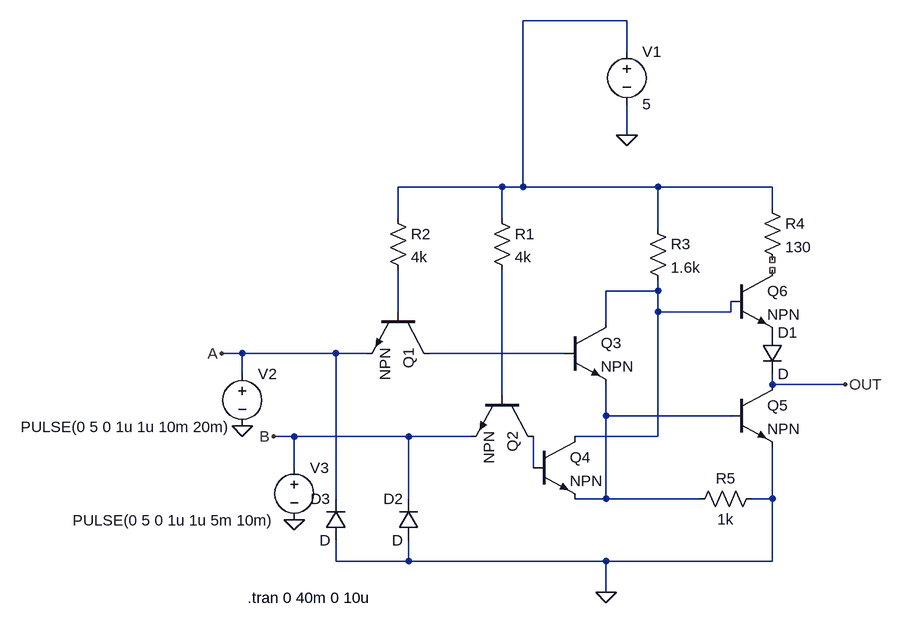
[diagram p0: schematic 74ls02_mock.asc]
74ls02_mock.asc, the LTspice schematic file:
Version 4.1
SHEET 1 880 680
WIRE 368 -352 208 -352
WIRE 368 -304 368 -352
WIRE 368 -176 368 -224
WIRE 176 -96 16 -96
WIRE 208 -96 208 -352
WIRE 208 -96 176 -96
WIRE 416 -96 208 -96
WIRE 592 -96 416 -96
WIRE 592 -64 592 -96
WIRE 16 -48 16 -96
WIRE 176 -48 176 -96
WIRE 416 -32 416 -96
WIRE 416 64 416 48
WIRE 416 64 336 64
WIRE 16 96 16 32
WIRE 416 96 416 64
WIRE 528 96 528 80
WIRE 528 96 416 96
WIRE 336 112 336 64
WIRE -224 160 -256 160
WIRE -80 160 -224 160
WIRE -32 160 -80 160
WIRE 272 160 64 160
WIRE -224 192 -224 160
WIRE 592 208 592 192
WIRE 704 208 592 208
WIRE 176 224 176 32
WIRE 336 256 336 208
WIRE 528 256 336 256
WIRE -144 288 -176 288
WIRE 32 288 -144 288
WIRE 128 288 32 288
WIRE 416 288 416 96
WIRE 416 288 288 288
WIRE -144 336 -144 288
WIRE 224 336 224 288
WIRE -80 384 -80 160
WIRE 32 384 32 288
WIRE 336 384 336 256
WIRE 336 384 288 384
WIRE 480 384 336 384
WIRE 592 384 592 304
WIRE 592 384 560 384
WIRE -80 480 -80 448
WIRE 32 480 32 448
WIRE 32 480 -80 480
WIRE 336 480 32 480
WIRE 592 480 592 384
WIRE 592 480 336 480
WIRE 336 528 336 480
FLAG 368 -176 0
FLAG -224 272 0
FLAG -144 416 0
FLAG -256 160 A
FLAG -176 288 B
FLAG 336 528 0
FLAG 704 208 OUT
SYMBOL voltage 368 -320 R0
WINDOW 123 0 0 Left 0
WINDOW 39 0 0 Left 0
SYMATTR InstName V1
SYMATTR Value 5
SYMBOL voltage -224 176 R0
WINDOW 3 -341 97 Left 2
WINDOW 123 0 0 Left 0
WINDOW 39 0 0 Left 0
SYMATTR InstName V2
SYMATTR Value PULSE(0 5 0 1u 1u 10m 20m)
SYMBOL voltage -144 320 R0
WINDOW 3 -341 97 Left 2
WINDOW 123 0 0 Left 0
WINDOW 39 0 0 Left 0
SYMATTR InstName V3
SYMATTR Value PULSE(0 5 0 1u 1u 5m 10m)
SYMBOL npn 64 96 R90
SYMATTR InstName Q1
SYMBOL npn 224 224 R90
SYMATTR InstName Q2
SYMBOL npn 272 112 R0
SYMATTR InstName Q3
SYMBOL npn 224 288 R0
SYMATTR InstName Q4
SYMBOL npn 528 208 R0
SYMATTR InstName Q5
SYMBOL npn 528 32 R0
SYMATTR InstName Q6
SYMBOL res 160 -64 R0
SYMATTR InstName R1
SYMATTR Value 4k
SYMBOL res 0 -64 R0
SYMATTR InstName R2
SYMATTR Value 4k
SYMBOL res 400 -48 R0
SYMATTR InstName R3
SYMATTR Value 1.6k
SYMBOL res 576 -80 R0
SYMATTR InstName R4
SYMATTR Value 130
SYMBOL diode 576 128 R0
SYMATTR InstName D1
SYMBOL res 576 368 R90
WINDOW 0 0 56 VBottom 2
WINDOW 3 32 56 VTop 2
SYMATTR InstName R5
SYMATTR Value 1k
SYMBOL diode 48 448 R180
WINDOW 0 24 64 Left 2
WINDOW 3 24 0 Left 2
SYMATTR InstName D2
SYMBOL diode -64 448 R180
WINDOW 0 24 64 Left 2
WINDOW 3 24 0 Left 2
SYMATTR InstName D3
TEXT -216 536 Left 2 !.tran 0 40m 0 10u

The netlist it stands for:
* 74ls02_mock.asc
V1 N001 0 5
V2 A 0 PULSE(0 5 0 1u 1u 10m 20m)
V3 B 0 PULSE(0 5 0 1u 1u 5m 10m)
Q1 N004 N003 A 0 NPN
Q2 N007 N005 B 0 NPN
Q3 N002 N004 N006 0 NPN
Q4 N002 N007 N006 0 NPN
Q5 OUT N006 0 0 NPN
Q6 NC_01 N002 P001 0 NPN
R1 N001 N005 4k
R2 N001 N003 4k
R3 N001 N002 1.6k
R4 N001 NC_02 130
D1 P001 OUT D
R5 0 N006 1k
D2 0 B D
D3 0 A D
.model D D
.lib standard.dio
.model NPN NPN
.model PNP PNP
.lib standard.bjt
.tran 0 40m 0 10u
.backanno
.end